# Altium schematic sheet NG2092_Connector_B.SchDoc: =project_title
size Tabloid; CompanyName: Luxonis Holding; Organization: Luxonis Holding; Address1: 1925 Harmony Park Drive; Address2: Westminster, CO; Address3: 80234; Address4: United States; SheetNumber: 3; SheetTotal: 12
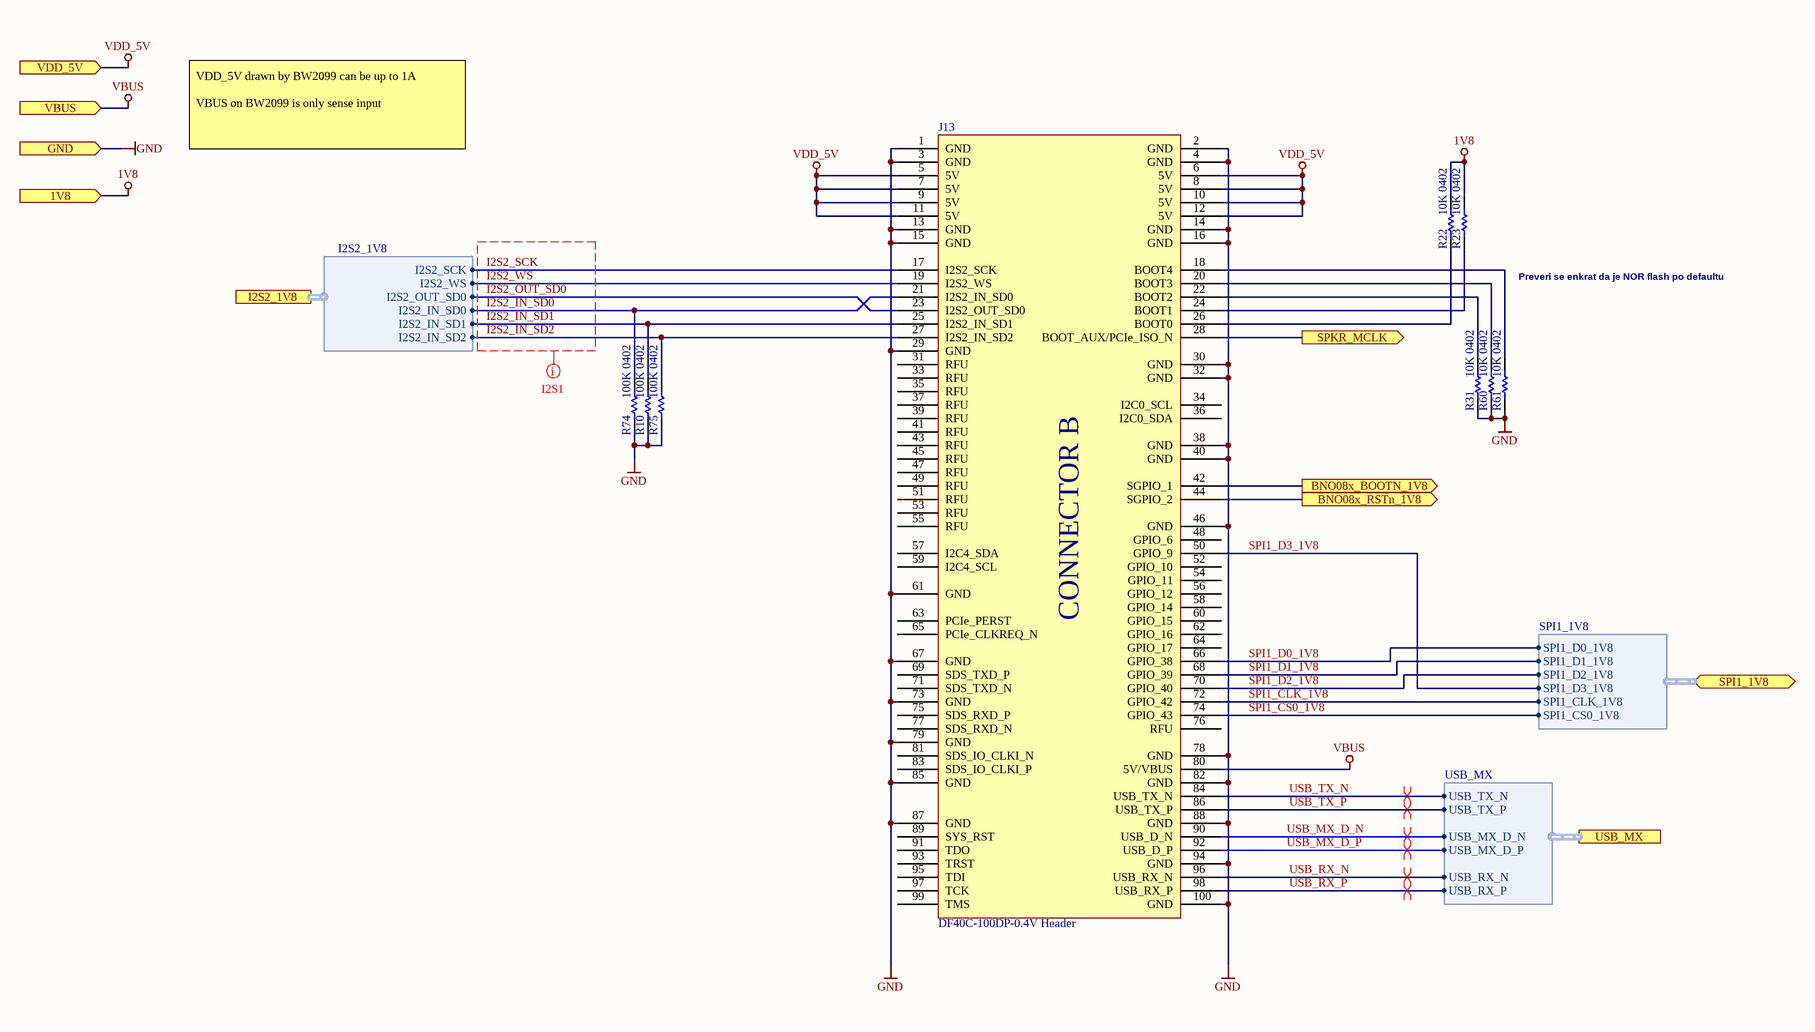
[diagram p0: NG2092_Connector_B.SchDoc]

## Parts
J13  DF40C-100DP-0.4V Header  [CON_BW2099_B]
R10  100K 0402  [RESC0402(1005)_L]
R22  10K 0402  [RESC0402(1005)_L]
R23  10K 0402  [RESC0402(1005)_L]
R31  10K 0402  [RESC0402(1005)_L]
R60  10K 0402  [RESC0402(1005)_L]
R61  10K 0402  [RESC0402(1005)_L]
R74  100K 0402  [RESC0402(1005)_L]
R75  100K 0402  [RESC0402(1005)_L]

## Ports
1V8 (in), BNO08x_BOOTN_1V8 (out), BNO08x_RSTn_1V8 (out), GND (in), I2S2_1V8 (harness I2S2_1V8), SPI1_1V8 (bidir, harness SPI1_1V8), SPKR_MCLK (out), USB_MX (harness USB_MX), VBUS (in), VDD_5V (in)

## Harnesses
USB_MX: USB_MX_D_P, USB_MX_D_N, USB_TX_N, USB_TX_P, USB_RX_N, USB_RX_P
I2S2_1V8: I2S2_SCK, I2S2_WS, I2S2_OUT_SD0, I2S2_IN_SD0, I2S2_IN_SD1, I2S2_IN_SD2
SPI1_1V8: SPI1_D0_1V8, SPI1_D1_1V8, SPI1_D2_1V8, SPI1_D3_1V8, SPI1_CLK_1V8, SPI1_CS0_1V8

## Nets
1V8: R22.2 R23.2 ; port 1V8
GND: J13.1(GND) J13.2(GND) J13.3(GND) J13.4(GND) J13.13(GND) J13.14(GND) J13.15(GND) J13.16(GND) J13.29(GND) J13.30(GND) J13.32(GND) J13.38(GND) J13.40(GND) J13.46(GND) J13.61(GND) J13.67(GND) J13.73(GND) J13.78(GND) J13.79(GND) J13.82(GND) J13.85(GND) J13.87(GND) J13.88(GND) J13.94(GND) J13.100(GND) R10.2 R31.1 R60.1 R61.1 R74.2 R75.2 ; port GND
VBUS: J13.80(5V/VBUS) ; port VBUS
VDD_5V: J13.5(5V) J13.6(5V) J13.7(5V) J13.8(5V) J13.9(5V) J13.10(5V) J13.11(5V) J13.12(5V) ; port VDD_5V
BNO08x_BOOTN_1V8: J13.42(SGPIO_1) ; port BNO08x_BOOTN_1V8
BNO08x_RSTn_1V8: J13.44(SGPIO_2) ; port BNO08x_RSTn_1V8
I2S2_IN_SD0: J13.21(I2S2_IN_SD0) R74.1 ; port I2S2_1V8.I2S2_IN_SD0
I2S2_IN_SD1: J13.25(I2S2_IN_SD1) R10.1 ; port I2S2_1V8.I2S2_IN_SD1
I2S2_IN_SD2: J13.27(I2S2_IN_SD2) R75.1 ; port I2S2_1V8.I2S2_IN_SD2
I2S2_OUT_SD0: J13.23(I2S2_OUT_SD0) ; port I2S2_1V8.I2S2_OUT_SD0
I2S2_SCK: J13.17(I2S2_SCK) ; port I2S2_1V8.I2S2_SCK
I2S2_WS: J13.19(I2S2_WS) ; port I2S2_1V8.I2S2_WS
SPI1_CLK_1V8: J13.72(GPIO_42) ; port SPI1_1V8.SPI1_CLK_1V8
SPI1_CS0_1V8: J13.74(GPIO_43) ; port SPI1_1V8.SPI1_CS0_1V8
SPI1_D0_1V8: J13.66(GPIO_38) ; port SPI1_1V8.SPI1_D0_1V8
SPI1_D1_1V8: J13.68(GPIO_39) ; port SPI1_1V8.SPI1_D1_1V8
SPI1_D2_1V8: J13.70(GPIO_40) ; port SPI1_1V8.SPI1_D2_1V8
SPI1_D3_1V8: J13.50(GPIO_9) ; port SPI1_1V8.SPI1_D3_1V8
SPKR_MCLK: J13.28(BOOT_AUX/PCIe_ISO_N) ; port SPKR_MCLK
USB_MX_D_N: J13.90(USB_D_N) ; port USB_MX.USB_MX_D_N
USB_MX_D_P: J13.92(USB_D_P) ; port USB_MX.USB_MX_D_P
USB_RX_N: J13.96(USB_RX_N) ; port USB_MX.USB_RX_N
USB_RX_P: J13.98(USB_RX_P) ; port USB_MX.USB_RX_P
USB_TX_N: J13.84(USB_TX_N) ; port USB_MX.USB_TX_N
USB_TX_P: J13.86(USB_TX_P) ; port USB_MX.USB_TX_P
NetJ13_18: J13.18(BOOT4) R61.2
NetJ13_20: J13.20(BOOT3) R60.2
NetJ13_22: J13.22(BOOT2) R31.2
NetJ13_24: J13.24(BOOT1) R23.1
NetJ13_26: J13.26(BOOT0) R22.1

Not connected (* = marked no-connect by the designer): J13 31(RFU) 33(RFU) 34(I2C0_SCL) 35(RFU) 36(I2C0_SDA) 37(RFU) 39(RFU) 41(RFU) 43(RFU) 45(RFU) 47(RFU) 48(GPIO_6) 49(RFU) 51(RFU) 52(GPIO_10) 53(RFU) 54(GPIO_11) 55(RFU) 56(GPIO_12) 57(I2C4_SDA) 58(GPIO_14) 59(I2C4_SCL) 60(GPIO_15) 62(GPIO_16) 63(PCIe_PERST) 64(GPIO_17) 65(PCIe_CLKREQ_N) 69(SDS_TXD_P) 71(SDS_TXD_N) 75(SDS_RXD_P) 76(RFU) 77(SDS_RXD_N) 81(SDS_IO_CLKI_N) 83(SDS_IO_CLKI_P) 89(SYS_RST) 91(TDO) 93(TRST) 95(TDI) 97(TCK) 99(TMS)

## Layout directives
differential pair; differential pair class 90ohm: USB_MX_D_N, USB_MX_D_P, USB_RX_N, USB_RX_P, USB_TX_N, USB_TX_P
net class I2S1: I2S2_IN_SD0, I2S2_IN_SD1, I2S2_IN_SD2, I2S2_OUT_SD0, I2S2_SCK, I2S2_WS

## Notes on the sheet
- VDD_5V drawn by BW2099 can be up to 1A
  VBUS on BW2099 is only sense input
- Preveri se enkrat da je NOR flash po defaultu
- Title
- Size:
- Date:
- Tabloid
- Number:
- Time:
- Revision:
- Sheet
- of
- Drawn by:
- (in symbol DF40C-100DP-0.4V_BW2099_B) CONNECTOR B

## Library data of the parts
J13 = DF40C-100DP-0.4V_BW2099_B: CONN HDR 100POS 0.4MM SMD GOLD BW2099 SYMBOL; Manufacturer 1: Hirose; Manufacturer Part Number 1: DF40HC(3.0)-100DS-0.4V(51; pin_current: 0.3A; Voltage Rating: 30V; Connector Type: Receptacle; Number of Positions: 100; Stack Height: 1.5mm; pin_pitch: 0.4mm; mfg_pn: DF40C-100DP-0.4V; Supplier 1: Digi-Key; Stock 1: 2172; Pricing 1: 1=2.54000, 10=2.26000, 25=2.07000, 50=2.07000, 100=1.98000, 250=1.79000, 500=1.65000, 1000=1.41000, 3000=1.32000, 6000=1.23000, 10000=1.23000 (USD); RoHS: Yes; Mount: Surface Mount; Contact Plating: Gold; Min Operating Temperature: -35°C; Max Operating Temperature: 85°C; Number of Rows: 2; Termination: SMD/SMT; Package Quantity: 1000; Packaging: Tape and Reel; Orientation: Straight; Pitch: 0.4mm; Radiation Hardening: No; REACH SVHC: Unknown; Lead Free: Lead Free; ComponentLink1URL: https://datasheet.ciiva.com/46636/ed-df40-20140305-46636517.pdf?src-supplier=Digi-Key; ComponentLink1Description: https://datasheet.ciiva.com/46636/ed-df40-20140305-46636517.pdf?src-supplier=Digi-Key; ComponentLink2URL: https://datasheet.ciiva.com/18562/ed-df40-20140305-18562189.pdf?src-supplier=Digi-Key; ComponentLink2Description: https://datasheet.ciiva.com/18562/ed-df40-20140305-18562189.pdf?src-supplier=Digi-Key; ComponentLink3URL: https://datasheet.ciiva.com/13559/ed-df40-20140305-13559540.pdf?src-supplier=Mouser; ComponentLink3Description: https://datasheet.ciiva.com/13559/ed-df40-20140305-13559540.pdf?src-supplier=Mouser; ComponentLink4URL: https://datasheet.ciiva.com/18562/ed-df40-20140305-18562462.pdf?src-supplier=Digi-Key; ComponentLink4Description: https://datasheet.ciiva.com/18562/ed-df40-20140305-18562462.pdf?src-supplier=Digi-Key; Supplier Part Number 1: 798-DF40HC30100DS451; Supplier 2: Mouser; Supplier Part Number 2: 798-DF40HC30100DS458; Manufacturer 2: Hirose; Manufacturer Part Number 2: DF40HC(3.0)-100DS-0.4V(58)
R10 R74 R75 = RC0402FR-07100KL: RES SMD 100K OHM 1% 1/16W 0402; Manufacturer 1: Yageo; Power Rating: 63mW; Resistance: 100kR; Temperature Coefficient: 100ppm/°C; Voltage Rating: 50V; Supplier 1: Digi-Key; Manufacturer Part Number 1: RC0402FR-07100KL; Stock 1: 50867324; Pricing 1: 1=0.10000, 10=0.01500, 100=0.00600, 1000=0.00270, 2500=0.00235, 5000=0.00194 (USD); RoHS: Yes; Case/Package: 0402; Case Code (Metric): 1005; Case Code (Imperial): 0402; Min Operating Temperature: -55°C; Max Operating Temperature: 155°C; Tolerance: 1%; Packaging: Tape and Reel; Composition: Thick Film; Termination: SMD/SMT; Military Standard: Not; Package Quantity: 1; Number of Terminations: 2; Max Power Dissipation: 63mW; Features: Moisture Resistant; Working Voltage: 50V; Length: 0.039inch; Height: 0.016inch; Width: 0.02inch; Depth: 0.5mm; Lead Free: Lead Free; REACH SVHC: No SVHC; ComponentLink1URL: https://datasheet.ciiva.com/11819/0900766b80c66297-11819452.pdf?src-supplier=RSComponents; ComponentLink1Description: https://datasheet.ciiva.com/11819/0900766b80c66297-11819452.pdf?src-supplier=RSComponents; ComponentLink2URL: https://datasheet.ciiva.com/2453/pyu-r-int-thick-7-2453361.pdf?src-supplier=Digi-Key; ComponentLink2Description: https://datasheet.ciiva.com/2453/pyu-r-int-thick-7-2453361.pdf?src-supplier=Digi-Key; ComponentLink3URL: https://datasheet.ciiva.com/2453/pyu-r-int-thick-7-2453362.pdf?src-supplier=Digi-Key; ComponentLink3Description: https://datasheet.ciiva.com/2453/pyu-r-int-thick-7-2453362.pdf?src-supplier=Digi-Key; ComponentLink4URL: https://datasheet.ciiva.com/2453/pyu-r-int-thick-7-2453363.pdf?src-supplier=Digi-Key; ComponentLink4Description: https://datasheet.ciiva.com/2453/pyu-r-int-thick-7-2453363.pdf?src-supplier=Digi-Key; ComponentLink5URL: https://datasheet.ciiva.com/22747/1018594-22747509.pdf?src-supplier=Element14; ComponentLink5Description: https://datasheet.ciiva.com/22747/1018594-22747509.pdf?src-supplier=Element14; ComponentLink6URL: https://datasheet.ciiva.com/15189/getdatasheetpartid-323696-15189334.pdf?src-supplier=Verical; ComponentLink6Description: https://datasheet.ciiva.com/15189/getdatasheetpartid-323696-15189334.pdf?src-supplier=Verical; ComponentLink7URL: https://datasheet.ciiva.com/12667/pyu-rc0402-51-rohs-l-6-r-12667930.pdf?src-supplier=Mouser; ComponentLink7Description: https://datasheet.ciiva.com/12667/pyu-rc0402-51-rohs-l-6-r-12667930.pdf?src-supplier=Mouser; Supplier 2: Newark; Supplier 3: Mouser; Supplier Part Number 1: 311-100KLRCT-ND; Supplier Part Number 2: 67R9887; Supplier Part Number 3: 603-RC0402FR-07100KL
R22 R23 R31 R60 R61 = RC0402FR-1310KL: RES SMD 10K OHM 1% 0402 1/16W Chip Resistor, 0402 [1005 Metric], 10 kohm, RC Series, 50 V, Thick Film, 62.5 mW; Manufacturer 1: Yageo; Resistance: 10kR; Temperature Coefficient: 100ppm/°C; Power Rating: 62.5mW; Voltage Rating: 50V; ComponentLink1URL: https://datasheet.ciiva.com/16940/pyu-rc0402-51-rohs-l-6-16940293.pdf?src-supplier=Avnet+Europe; ComponentLink1Description: https://datasheet.ciiva.com/16940/pyu-rc0402-51-rohs-l-6-16940293.pdf?src-supplier=Avnet+Europe; ComponentLink2URL: https://datasheet.ciiva.com/28386/pyu-rc0402-51-rohs-l-6-28386855.pdf?src-supplier=Avnet+Europe; ComponentLink2Description: https://datasheet.ciiva.com/28386/pyu-rc0402-51-rohs-l-6-28386855.pdf?src-supplier=Avnet+Europe; ComponentLink3URL: https://datasheet.ciiva.com/16740/pyu-rc0402-51-rohs-l-6-r-16740602.pdf?src-supplier=Future+Electronics; ComponentLink3Description: https://datasheet.ciiva.com/16740/pyu-rc0402-51-rohs-l-6-r-16740602.pdf?src-supplier=Future+Electronics; ComponentLink4URL: https://datasheet.ciiva.com/8891/pyu-rc0402-51-rohs-l-6-8891339.pdf?src-supplier=Avnet; ComponentLink4Description: https://datasheet.ciiva.com/8891/pyu-rc0402-51-rohs-l-6-8891339.pdf?src-supplier=Avnet; ComponentLink5URL: https://datasheet.ciiva.com/5557/pyu-rc0402-51-rohs-l-6-r-5557997.pdf?src-supplier=Mouser; ComponentLink5Description: https://datasheet.ciiva.com/5557/pyu-rc0402-51-rohs-l-6-r-5557997.pdf?src-supplier=Mouser; ComponentLink6URL: https://datasheet.ciiva.com/7983/1018594-7983533.pdf?src-supplier=Element14; ComponentLink6Description: https://datasheet.ciiva.com/7983/1018594-7983533.pdf?src-supplier=Element14; Supplier 1: Newark; Manufacturer Part Number 1: RC0402FR-1310KL; Stock 1: 62239; Pricing 1: 1=0.10000, 25=0.01200, 100=0.00400, 250=0.00400, 500=0.00300, 1000=0.00300 (USD); RoHS: Yes; Case/Package: 0402; Number of Pins: 2; Contact Plating: Tin,Matte,Lead; Case Code (Imperial): 0402; Case Code (Metric): 1005; Min Operating Temperature: -55°C; Max Operating Temperature: 155°C; Tolerance: 1%; Composition: Thick Film; Packaging: Tape and Reel; Termination: SMD/SMT; Military Standard: Not; Voltage Rating (DC): 50V; Working Voltage: 50V; Number of Terminations: 2; Length: 1mm; Depth: 0.5mm; Radiation Hardening: No; REACH SVHC: No SVHC; Lead Free: Lead Free; Supplier Part Number 1: 67R9960; Supplier 2: Future Electronics; Supplier 3: Mouser; Supplier 4: Element14; Supplier Part Number 2: RC0402FR-1310KL-CUTT; Supplier Part Number 3: 603-RC0402FR-1310KL; Supplier Part Number 4: 1799235